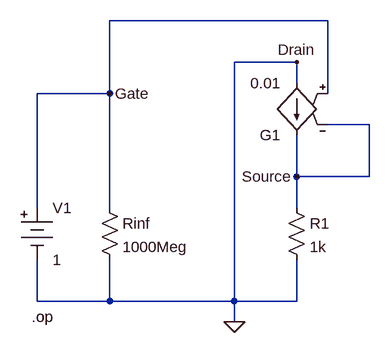
[diagram p0: schematic g3_p21.asc]
g3_p21.asc, the LTspice schematic file:
Version 4
SHEET 1 880 680
WIRE 368 -32 32 -32
WIRE 320 32 224 32
WIRE 320 64 320 32
WIRE 32 80 32 -32
WIRE 32 80 -80 80
WIRE 368 80 368 -32
WIRE 432 128 368 128
WIRE 320 208 320 144
WIRE 432 208 432 128
WIRE 432 208 320 208
WIRE -80 256 -80 80
WIRE 32 256 32 80
WIRE 320 256 320 208
WIRE -80 400 -80 336
WIRE 32 400 32 336
WIRE 32 400 -80 400
WIRE 224 400 224 32
WIRE 224 400 32 400
WIRE 320 400 320 336
WIRE 320 400 224 400
WIRE 224 432 224 400
FLAG 32 80 Gate
FLAG 320 208 Source
FLAG 320 32 Drain
FLAG 224 432 0
SYMBOL Misc\\battery -80 240 R0
SYMATTR InstName V1
SYMATTR Value 1
SYMBOL res 304 240 R0
SYMATTR InstName R1
SYMATTR Value 1k
SYMBOL res 16 240 R0
SYMATTR InstName Rinf
SYMATTR Value 1000Meg
SYMBOL g2 320 160 R180
SYMATTR InstName G1
SYMATTR Value 0.01
TEXT -88 424 Left 2 !.op

The netlist it stands for:
* g3_p21.asc
V1 Gate 0 1
R1 Source 0 1k
Rinf Gate 0 1000Meg
G1 0 Source Gate Source 0.01
.op
.backanno
.end